# EAGLE schematic LoPoSwitch-BLE (EAGLE 8.7.0)
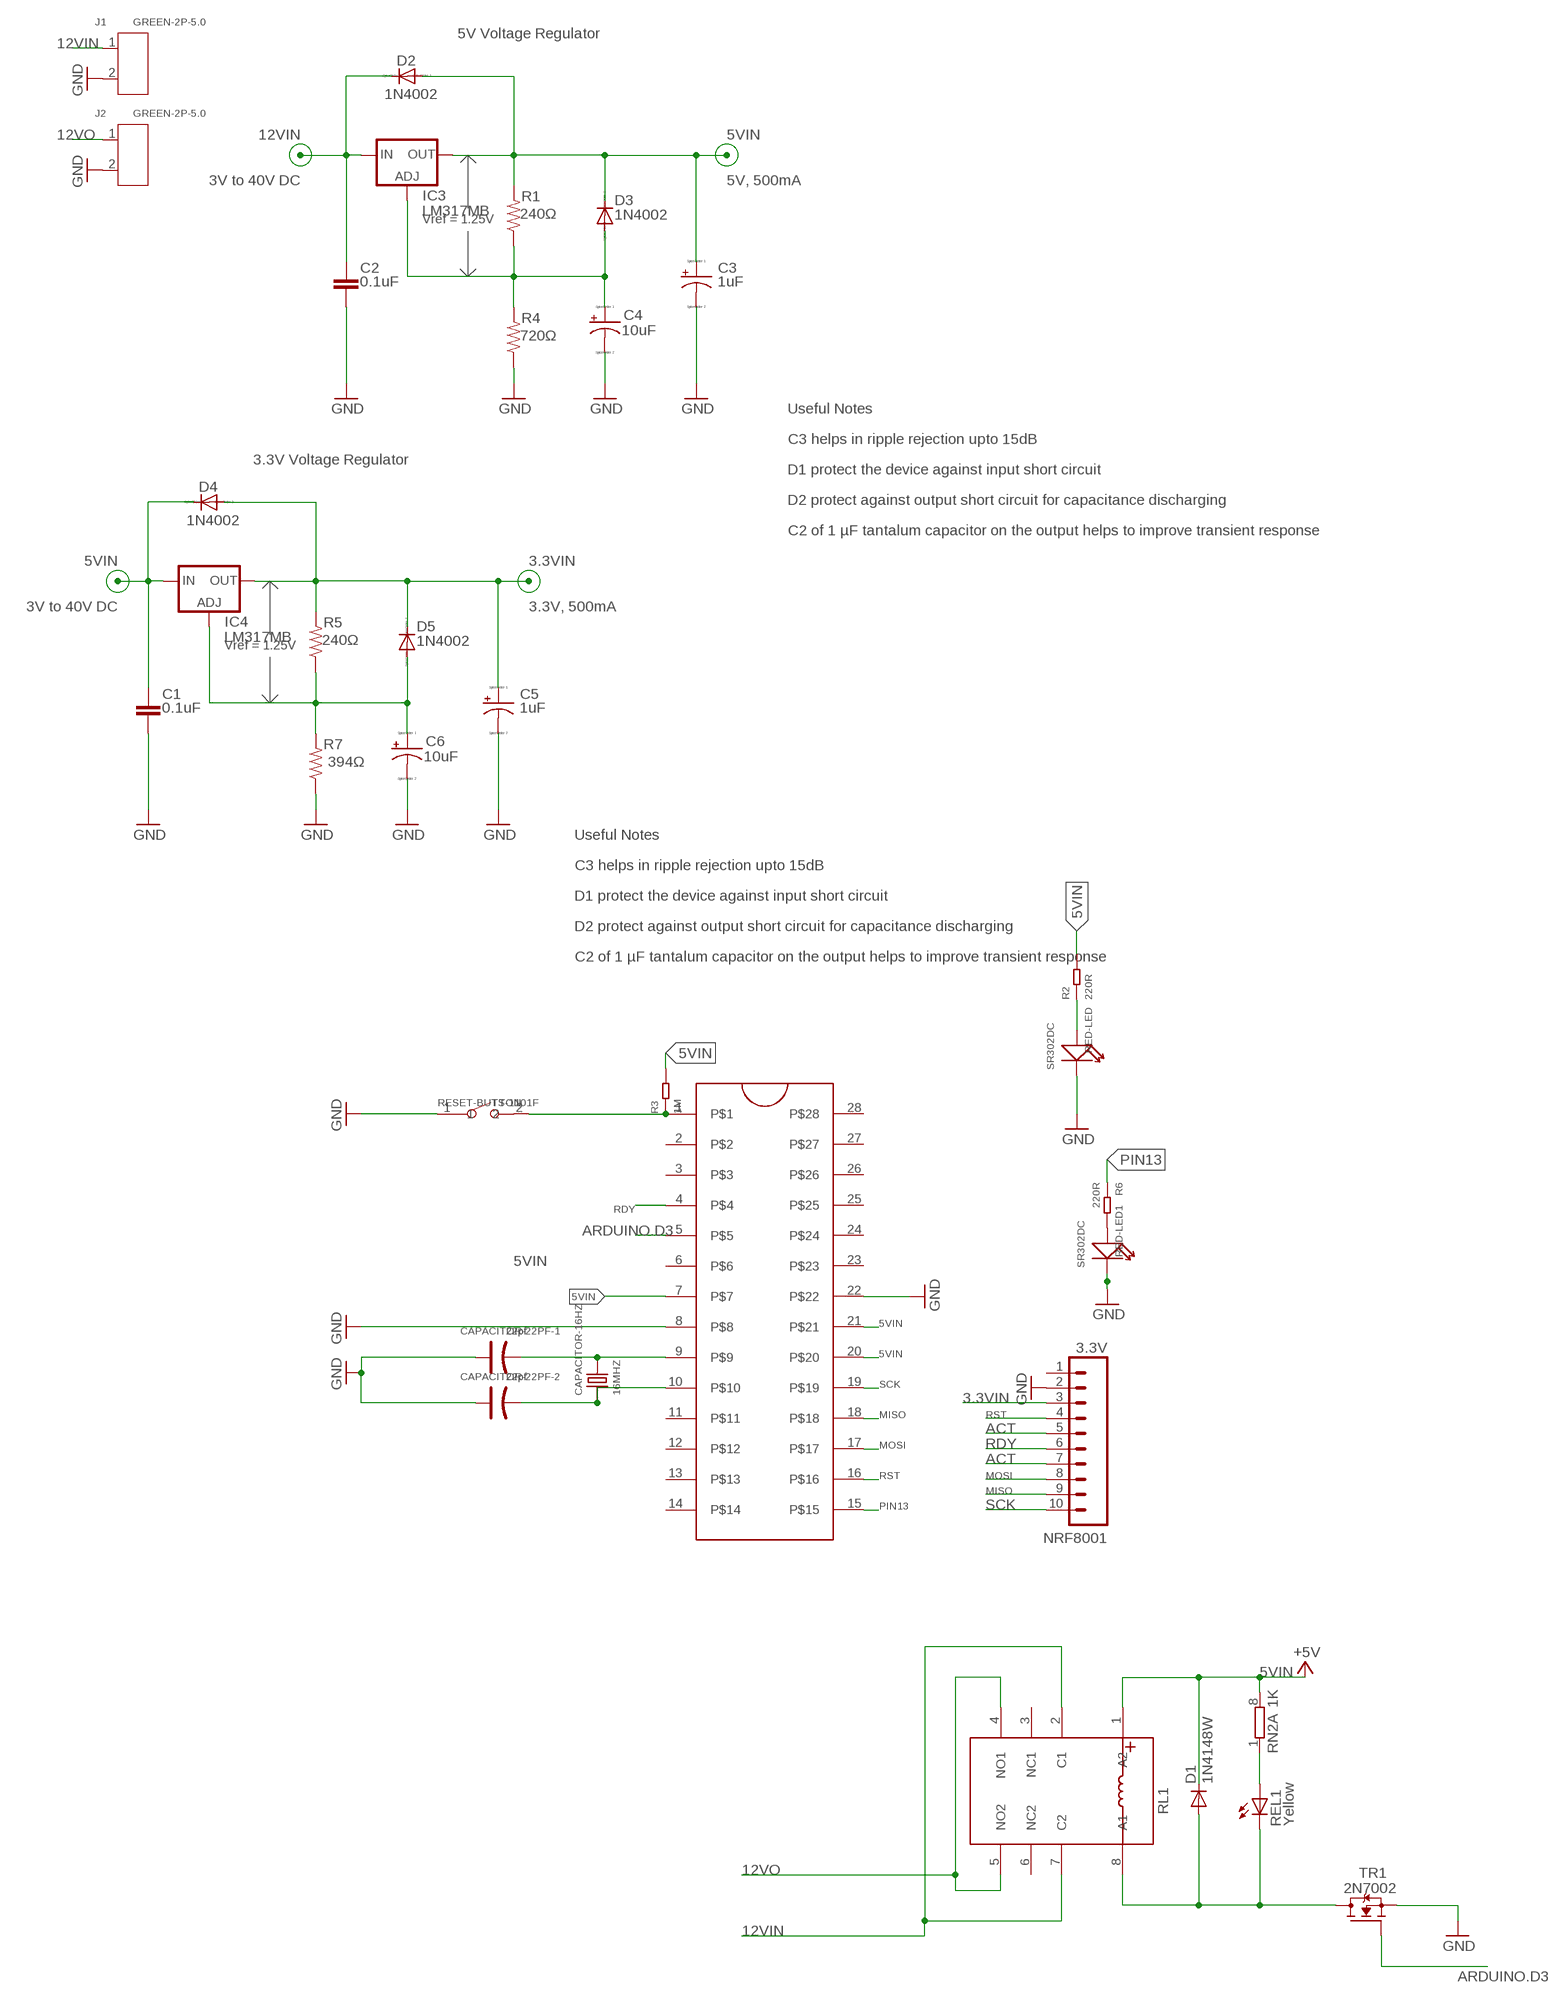
[diagram p0: schematic, sheet 1]

## Parts
ATMEGA328  ZIFSOCKET-28-3ZIFFSOCKET-28-3  [DIL28-3-ZIF_SOCKET]
C1  0.1uF  C-EU075-052X106  [C075-052X106]
C2  0.1uF  C-EU075-052X106  [C075-052X106]
C3  1uF  CPOL-US085CS-1AR  [085CS_1AR]
C4  10uF  CPOL-US085CS-1AR  [085CS_1AR]
C5  1uF  CPOL-US085CS-1AR  [085CS_1AR]
C6  10uF  CPOL-US085CS-1AR  [085CS_1AR]
CAPACITOR-16HZ  16MHZ  DIP-CRYSTAL-16MHZ-18PF-30PPM-50R(HC49US)  [HC49US]
CAPACITOR-22PF-1  22pf  DIP-ALUMINUM-47UF-16V(D5-H7MM)  [PC-D5.3MM]
CAPACITOR-22PF-2  22pf  DIP-ALUMINUM-47UF-16V(D5-H7MM)  [PC-D5.3MM]
D1  1N4148W  0290_1N4148W  [SOD123]
D2  1N4002  1N4004  [DO41-10]
D3  1N4002  1N4004  [DO41-10]
D4  1N4002  1N4004  [DO41-10]
D5  1N4002  1N4004  [DO41-10]
IC3  LM317MB  [TO220L1]
IC4  LM317MB  [TO220L1]
J1  GREEN-2P-5.0  SCREW-TERMINAL-GREEN(2P-5.0)  [H2-5.0-10.5X8.0MM]
J2  GREEN-2P-5.0  SCREW-TERMINAL-GREEN(2P-5.0)  [H2-5.0-10.5X8.0MM]
NRF8001  3.3V  M10SILK_FEMALE_PTH  [1X10]
R1  240Ω  R-US_M0805  [M0805]
R2  220R  DIP-RES-220R-5%-1/4W(PR-D2.3XL6.5MM)  [PR-D2.3XL6.5MM]
R3  1M  DIP-RES-1M-5%-1/4W(PR-D2.3XL6.5MM)  [PR-D2.3XL6.5MM]
R4  720Ω  R-US_M0805  [M0805]
R5  240Ω  R-US_M0805  [M0805]
R6  220R  DIP-RES-220R-5%-1/4W(PR-D2.3XL6.5MM)  [PR-D2.3XL6.5MM]
R7  394Ω  R-US_M0805  [M0805]
RED-LED  SR302DC  DIP-LED-RED-RED(2P-D3MM)  [LED2-2.54-D3.0MM]
RED-LED1  SR302DC  DIP-LED-RED-RED(2P-D3MM)  [LED2-2.54-D3.0MM]
REL1  Yellow  0044_KPT-2012YC  [CHIPLED_0805]
RESET-BUTTON  TS-1101F  DIP-BUTTON(2P-6.0X3.0X4.3MM)-TS-1101F  [SW2-5.0-6.0X3.0X4.3MM]
RL1  1045_G5V-2-H1  [RELE'-30SSERIES-DIL-2X]
RN2  1K  0005_064R_1K_/_CAY16-102J4LF  [CAY16]
TR1  2N7002  1612_2N7002LT1G  [SOT-23]

## Nets
3.3VIN: C5.+ D4.A D5.C IC4.2(OUT) NRF8001.3 R5.2
5VIN: ATMEGA328.7 ATMEGA328.20 ATMEGA328.21 C1.1 C3.+ D1.C D2.A D3.C D4.C IC3.2(OUT) IC4.3(IN) R1.2 R2.2 R3.2 RL1.1(A2) RN2.8 ; supply symbol labelled +5V
12VIN: C2.1 D2.C IC3.3(IN) J1.1 RL1.2(C1) RL1.7(C2)
12VO [RelayOut]: J2.1 RL1.4(NO1) RL1.5(NO2)
ACT: NRF8001.5 NRF8001.7
ARDUINO.D3: ATMEGA328.5 TR1.3(G)
GND: ATMEGA328.8 ATMEGA328.22 C1.2 C2.2 C3.- C4.- C5.- C6.- CAPACITOR-22PF-1.+ CAPACITOR-22PF-2.+ J1.2 J2.2 NRF8001.2 R4.1 R7.1 RED-LED1.K(-) RED-LED.K(-) RESET-BUTTON.1 TR1.2(S)
MISO: ATMEGA328.18 NRF8001.9
MOSI: ATMEGA328.17 NRF8001.8
N$1: C4.+ D3.A IC3.1(ADJ) R1.1 R4.2
N$2: R6.2 RED-LED1.A(+)
N$3: ATMEGA328.1 R3.1 RESET-BUTTON.2
N$4: C6.+ D5.A IC4.1(ADJ) R5.1 R7.2
N$5: REL1.A RN2.1
N$8: R2.1 RED-LED.A(+)
N$10: ATMEGA328.9 CAPACITOR-16HZ.2 CAPACITOR-22PF-1.-
N$11: ATMEGA328.10 CAPACITOR-16HZ.1 CAPACITOR-22PF-2.-
N$14: D1.A REL1.C RL1.8(A1) TR1.1(D)
PIN13: ATMEGA328.15 R6.1
RDY: ATMEGA328.4 NRF8001.6
RST: ATMEGA328.16 NRF8001.4
SCK: ATMEGA328.19 NRF8001.10
Unconnected: ATMEGA328.2 ATMEGA328.3 ATMEGA328.6 ATMEGA328.11 ATMEGA328.12 ATMEGA328.13 ATMEGA328.14 ATMEGA328.23 ATMEGA328.24 ATMEGA328.25 ATMEGA328.26 ATMEGA328.27 ATMEGA328.28 NRF8001.1 RL1.3(NC1) RL1.6(NC2) RN2.2 RN2.3 RN2.4 RN2.5 RN2.6 RN2.7

## Notes on the sheet
- 5V Voltage Regulator
- 3V to 40V DC | 5V, 500mA
- Vref = 1.25V
- Useful Notes
- C3 helps in ripple rejection upto 15dB
- 3.3V Voltage Regulator
- D1 protect the device against input short circuit
- D2 protect against output short circuit for capacitance discharging
- C2 of 1 µF tantalum capacitor on the output helps to improve transient response
- 3V to 40V DC | 3.3V, 500mA
- Vref = 1.25V
- Useful Notes
- C3 helps in ripple rejection upto 15dB
- D1 protect the device against input short circuit
- D2 protect against output short circuit for capacitance discharging
- C2 of 1 µF tantalum capacitor on the output helps to improve transient response

## Library data of the parts
ATMEGA328 = SparkFun-Connectors:ZIFSOCKET-28-3: Lever-action ZIF socket for 28-pin ICs; OC_FARNELL: unknown
C1 C2 = rcl:C-EU: CAPACITOR, European symbol; OC_FARNELL: unknown
C3-C6 = resistor:CPOL-US: POLARIZED CAPACITOR, American symbol; OC_FARNELL: unknown
CAPACITOR-16HZ = Seeed-Crystal Oscillator:DIP-CRYSTAL-16MHZ-18PF-30PPM-50R(HC49US): 306010037; OC_FARNELL: unknown
CAPACITOR-22PF-1 CAPACITOR-22PF-2 = Seeed-Capacitor:DIP-ALUMINUM-47UF-16V(D5-H7MM): 302030033; OC_FARNELL: unknown; VALUE: 100uf
D1 = Diodi:0290_1N4148W: FAST SMALL SIGNAL DIODES SMD 200mA 100V SOD123; CASE: SOD123; MONTHLY_USAGE: _____; OC_FARNELL: unknown; PART_NUMBER: 1N4148W; PRICE: _____; SUPPLIER: _____; TYPE: Diodi
D2-D5 = diode:1N4004: DIODE general purpose rectifier, 1 A; OC_FARNELL: unknown
IC3 IC4 = Texas Instruments_By_element14_Batch_1:LM317?*: 500 mA Adjustable Output Positive Voltage Regulator Source: http://www.onsemi.co.jp .. LM317M-D.PDF; MPN: LM317MABTG; OC_FARNELL: unknown
J1 J2 = Seeed-Connector:SCREW-TERMINAL-GREEN(2P-5.0): 320110031; OC_FARNELL: unknown
NRF8001 = SparkFun-Connectors:M10: Header 10 Standard 10-pin 0.1" header. Use with straight break away headers (SKU : PRT-00116), right angle break away headers (PRT-00553), swiss pins (PRT-00743), machine pins (PRT-00117), and female headers (PRT-00115).; OC_FARNELL: unknown; PROD_ID: CONN-11563
R1 R4 R5 R7 = resistor:R-US_: RESISTOR, American symbol; OC_FARNELL: unknown
R2 R6 = Seeed-Resistor:DIP-RES-220R-5%-1/4W(PR-D2.3XL6.5MM): 301020011; OC_FARNELL: unknown
R3 = Seeed-Resistor:DIP-RES-1M-5%-1/4W(PR-D2.3XL6.5MM): 301020005; OC_FARNELL: unknown
RED-LED RED-LED1 = Seeed-LED:DIP-LED-RED-RED(2P-D3MM): 304090041; OC_FARNELL: unknown
REL1 = Opto:0044_KPT-2012YC: LED YELLOW - SMD - 0805; MONTHLY_USAGE: _____; OC_FARNELL: unknown; PART_NUMBER: KPT-2012YC; PRICE: _____; SUPPLIER: _____; TYPE: Opto
RESET-BUTTON = Seeed-Switch:DIP-BUTTON(2P-6.0X3.0X4.3MM): 311020025; OC_FARNELL: unknown
RL1 = Rele':1045_G5V-2-H1: Rel� 5V nero Omron; MONTHLY_USAGE: _____; OC_FARNELL: unknown; PART_NUMBER: G5V-2-H1; PRICE: _____; SUPPLIER: _____; TYPE: Rele'; VALUE: G5V-2-H1
RN2 = Resistenze:0005_064R_1K_/_CAY16-102J4LF: 1K 064R; CASE: SMD_3,2x1,6; MONTHLY_USAGE: _____; OC_FARNELL: unknown; PART_NUMBER: 064R_1K_/_CAY16-102J4LF; PRICE: _____; SUPPLIER: _____; TYPE: Resistenze
TR1 = Transistors:1612_2N7002LT1G: 2N7002 60 V, 300 mA N-channel Trench MOSFET; OC_FARNELL: unknown

## Net classes
1 power: width 0.305 mm, drill 0.61 mm, clearance 0.305 mm
3 RelayOut: width 1.27 mm, clearance 4 mm to class 0, clearance 4 mm to class 1, clearance 4 mm to class 2, clearance 1.27 mm